# EAGLE schematic schema (EAGLE 6.5.0)
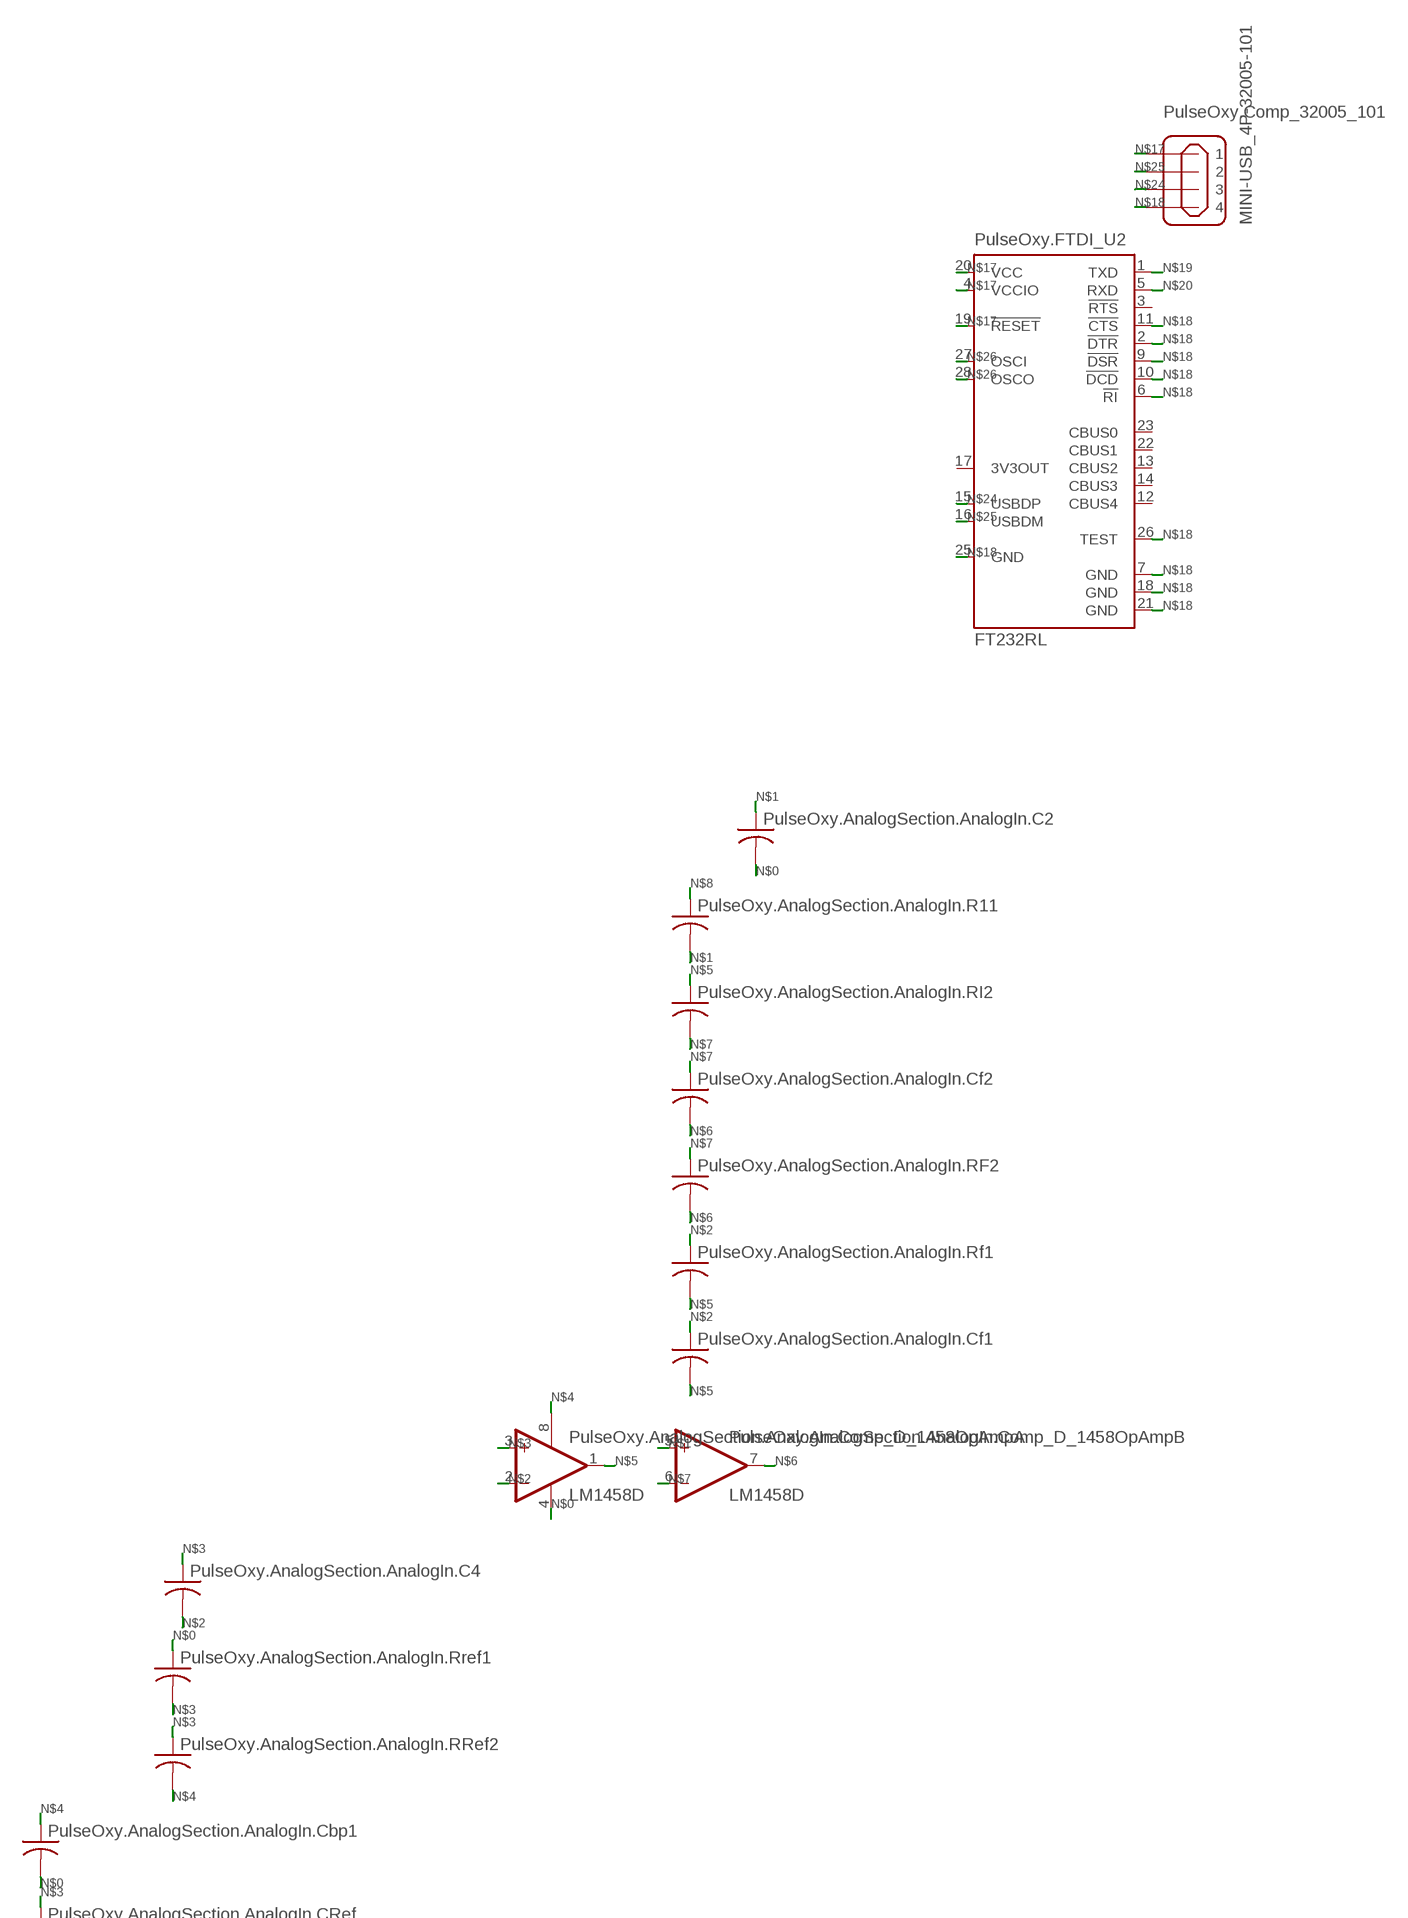
[diagram p0: schematic, sheet 1, part 1 of 2]
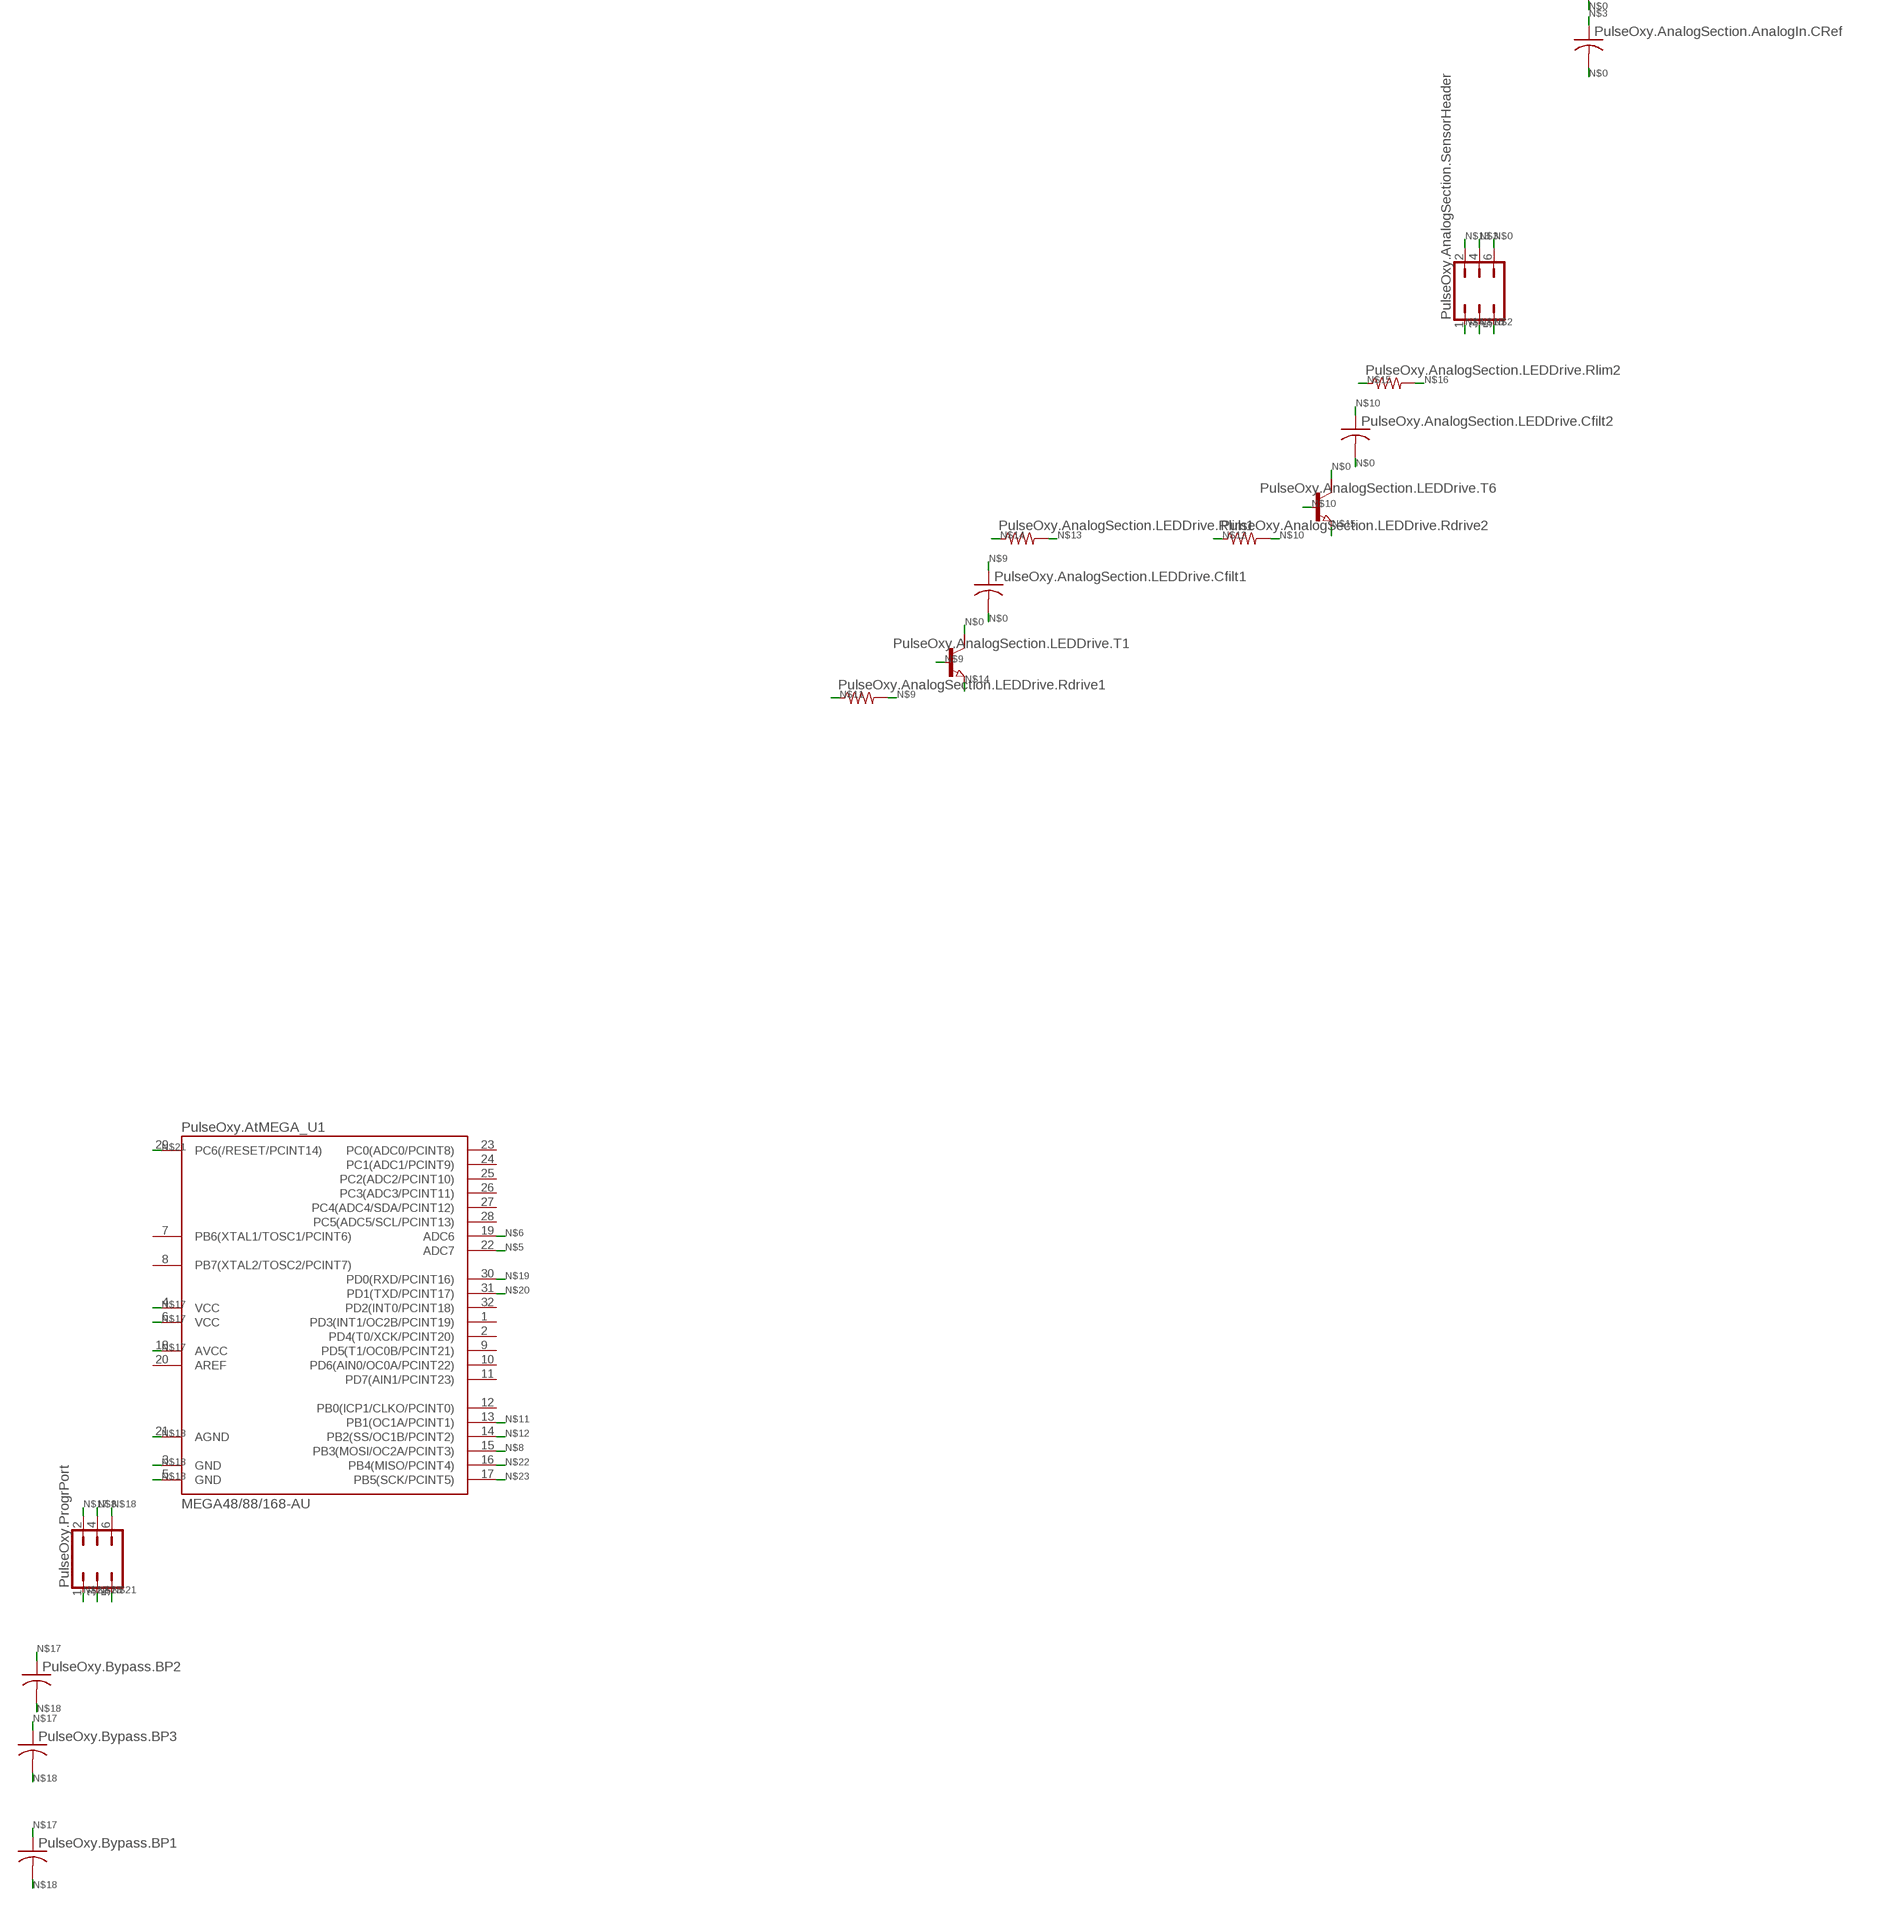
[diagram p1: schematic, sheet 1, part 2 of 2]

## Parts
PulseOxy.AnalogSection.AnalogIn.C2  C-USC0805  [C0805]
PulseOxy.AnalogSection.AnalogIn.C4  C-USC0805  [C0805]
PulseOxy.AnalogSection.AnalogIn.Cbp1  C-USC0805  [C0805]
PulseOxy.AnalogSection.AnalogIn.Cf1  C-USC0805  [C0805]
PulseOxy.AnalogSection.AnalogIn.Cf2  C-USC0805  [C0805]
PulseOxy.AnalogSection.AnalogIn.Comp_D_1458OpAmp  LM1458D  [SO08]
PulseOxy.AnalogSection.AnalogIn.CRef  C-USC0805  [C0805]
PulseOxy.AnalogSection.AnalogIn.R11  C-USC0603  [C0603]
PulseOxy.AnalogSection.AnalogIn.Rf1  C-USC0603  [C0603]
PulseOxy.AnalogSection.AnalogIn.RF2  C-USC0603  [C0603]
PulseOxy.AnalogSection.AnalogIn.RI2  C-USC0603  [C0603]
PulseOxy.AnalogSection.AnalogIn.Rref1  C-USC0603  [C0603]
PulseOxy.AnalogSection.AnalogIn.RRef2  C-USC0603  [C0603]
PulseOxy.AnalogSection.LEDDrive.Cfilt1  C-USC0805  [C0805]
PulseOxy.AnalogSection.LEDDrive.Cfilt2  C-USC0805  [C0805]
PulseOxy.AnalogSection.LEDDrive.Rdrive1  R-US_R0603  [R0603]
PulseOxy.AnalogSection.LEDDrive.Rdrive2  R-US_R0603  [R0603]
PulseOxy.AnalogSection.LEDDrive.Rlim1  R-US_R0603  [R0603]
PulseOxy.AnalogSection.LEDDrive.Rlim2  R-US_R0603  [R0603]
PulseOxy.AnalogSection.LEDDrive.T1  NPN-TRANSISTIOR-2COLSOT143  [SOT143]
PulseOxy.AnalogSection.LEDDrive.T6  NPN-TRANSISTIOR-2COLSOT143  [SOT143]
PulseOxy.AnalogSection.SensorHeader  JP3Q  [JP3Q]
PulseOxy.AtMEGA_U1  MEGA48/88/168-AU  [TQFP32-08]
PulseOxy.Bypass.BP1  C-USC0805  [C0805]
PulseOxy.Bypass.BP2  C-USC0805  [C0805]
PulseOxy.Bypass.BP3  C-USC0805  [C0805]
PulseOxy.Comp_32005_101  MINI-USB_4P-32005-101  [32005-101]
PulseOxy.FTDI_U2  FT232RL  [SSOP28]
PulseOxy.ProgrPort  JP3Q  [JP3Q]

## Nets
N$0: PulseOxy.AnalogSection.AnalogIn.C2.2 PulseOxy.AnalogSection.AnalogIn.Cbp1.2 PulseOxy.AnalogSection.AnalogIn.Comp_D_1458OpAmp.4(P:V-) PulseOxy.AnalogSection.AnalogIn.CRef.2 PulseOxy.AnalogSection.AnalogIn.Rref1.1 PulseOxy.AnalogSection.LEDDrive.Cfilt1.2 PulseOxy.AnalogSection.LEDDrive.Cfilt2.2 PulseOxy.AnalogSection.LEDDrive.T1.2(C) PulseOxy.AnalogSection.LEDDrive.T6.2(C) PulseOxy.AnalogSection.SensorHeader.6
N$1: PulseOxy.AnalogSection.AnalogIn.C2.1 PulseOxy.AnalogSection.AnalogIn.Comp_D_1458OpAmp.5(B:+IN) PulseOxy.AnalogSection.AnalogIn.R11.2
N$2: PulseOxy.AnalogSection.AnalogIn.C4.2 PulseOxy.AnalogSection.AnalogIn.Cf1.1 PulseOxy.AnalogSection.AnalogIn.Comp_D_1458OpAmp.2(A:-IN) PulseOxy.AnalogSection.AnalogIn.Rf1.1 PulseOxy.AnalogSection.SensorHeader.5
N$3: PulseOxy.AnalogSection.AnalogIn.C4.1 PulseOxy.AnalogSection.AnalogIn.Comp_D_1458OpAmp.3(A:+IN) PulseOxy.AnalogSection.AnalogIn.CRef.1 PulseOxy.AnalogSection.AnalogIn.Rref1.2 PulseOxy.AnalogSection.AnalogIn.RRef2.1 PulseOxy.AnalogSection.SensorHeader.4
N$4: PulseOxy.AnalogSection.AnalogIn.Cbp1.1 PulseOxy.AnalogSection.AnalogIn.Comp_D_1458OpAmp.8(P:V+) PulseOxy.AnalogSection.AnalogIn.RRef2.2 PulseOxy.AnalogSection.SensorHeader.1
N$5: PulseOxy.AnalogSection.AnalogIn.Cf1.2 PulseOxy.AnalogSection.AnalogIn.Comp_D_1458OpAmp.1(A:OUT) PulseOxy.AnalogSection.AnalogIn.Rf1.2 PulseOxy.AnalogSection.AnalogIn.RI2.1 PulseOxy.AtMEGA_U1.22(ADC7)
N$6: PulseOxy.AnalogSection.AnalogIn.Cf2.2 PulseOxy.AnalogSection.AnalogIn.Comp_D_1458OpAmp.7(B:OUT) PulseOxy.AnalogSection.AnalogIn.RF2.2 PulseOxy.AtMEGA_U1.19(ADC6)
N$7: PulseOxy.AnalogSection.AnalogIn.Cf2.1 PulseOxy.AnalogSection.AnalogIn.Comp_D_1458OpAmp.6(B:-IN) PulseOxy.AnalogSection.AnalogIn.RF2.1 PulseOxy.AnalogSection.AnalogIn.RI2.2
N$8: PulseOxy.AnalogSection.AnalogIn.R11.1 PulseOxy.AtMEGA_U1.15(PB3(MOSI/OC2A/PCINT3)) PulseOxy.ProgrPort.4
N$9: PulseOxy.AnalogSection.LEDDrive.Cfilt1.1 PulseOxy.AnalogSection.LEDDrive.Rdrive1.2 PulseOxy.AnalogSection.LEDDrive.T1.1(B)
N$10: PulseOxy.AnalogSection.LEDDrive.Cfilt2.1 PulseOxy.AnalogSection.LEDDrive.Rdrive2.2 PulseOxy.AnalogSection.LEDDrive.T6.1(B)
N$11: PulseOxy.AnalogSection.LEDDrive.Rdrive1.1 PulseOxy.AtMEGA_U1.13(PB1(OC1A/PCINT1))
N$12: PulseOxy.AnalogSection.LEDDrive.Rdrive2.1 PulseOxy.AtMEGA_U1.14(PB2(SS/OC1B/PCINT2))
N$13: PulseOxy.AnalogSection.LEDDrive.Rlim1.2 PulseOxy.AnalogSection.SensorHeader.2
N$14: PulseOxy.AnalogSection.LEDDrive.Rlim1.1 PulseOxy.AnalogSection.LEDDrive.T1.3(E)
N$15: PulseOxy.AnalogSection.LEDDrive.Rlim2.1 PulseOxy.AnalogSection.LEDDrive.T6.3(E)
N$16: PulseOxy.AnalogSection.LEDDrive.Rlim2.2 PulseOxy.AnalogSection.SensorHeader.3
N$17: PulseOxy.AtMEGA_U1.4(VCC) PulseOxy.AtMEGA_U1.6(VCC) PulseOxy.AtMEGA_U1.18(AVCC) PulseOxy.Bypass.BP1.1 PulseOxy.Bypass.BP2.1 PulseOxy.Bypass.BP3.1 PulseOxy.Comp_32005_101.1 PulseOxy.FTDI_U2.4(VCCIO) PulseOxy.FTDI_U2.19(!RESET) PulseOxy.FTDI_U2.20(VCC) PulseOxy.ProgrPort.2
N$18: PulseOxy.AtMEGA_U1.3(GND) PulseOxy.AtMEGA_U1.5(GND) PulseOxy.AtMEGA_U1.21(AGND) PulseOxy.Bypass.BP1.2 PulseOxy.Bypass.BP2.2 PulseOxy.Bypass.BP3.2 PulseOxy.Comp_32005_101.4 PulseOxy.FTDI_U2.2(!DTR) PulseOxy.FTDI_U2.6(!RI) PulseOxy.FTDI_U2.7(GND) PulseOxy.FTDI_U2.9(!DSR) PulseOxy.FTDI_U2.10(!DCD) PulseOxy.FTDI_U2.11(!CTS) PulseOxy.FTDI_U2.18(GND) PulseOxy.FTDI_U2.21(GND) PulseOxy.FTDI_U2.25(GND) PulseOxy.FTDI_U2.26(TEST) PulseOxy.ProgrPort.6
N$19: PulseOxy.AtMEGA_U1.30(PD0(RXD/PCINT16)) PulseOxy.FTDI_U2.1(TXD)
N$20: PulseOxy.AtMEGA_U1.31(PD1(TXD/PCINT17)) PulseOxy.FTDI_U2.5(RXD)
N$21: PulseOxy.AtMEGA_U1.29(PC6(/RESET/PCINT14)) PulseOxy.ProgrPort.5
N$22: PulseOxy.AtMEGA_U1.16(PB4(MISO/PCINT4)) PulseOxy.ProgrPort.1
N$23: PulseOxy.AtMEGA_U1.17(PB5(SCK/PCINT5)) PulseOxy.ProgrPort.3
N$24: PulseOxy.Comp_32005_101.3 PulseOxy.FTDI_U2.15(USBDP)
N$25: PulseOxy.Comp_32005_101.2 PulseOxy.FTDI_U2.16(USBDM)
N$26: PulseOxy.FTDI_U2.27(OSCI) PulseOxy.FTDI_U2.28(OSCO)
Unconnected: PulseOxy.AnalogSection.LEDDrive.T1.4(C/) PulseOxy.AnalogSection.LEDDrive.T6.4(C/) PulseOxy.AtMEGA_U1.1(PD3(INT1/OC2B/PCINT19)) PulseOxy.AtMEGA_U1.2(PD4(T0/XCK/PCINT20)) PulseOxy.AtMEGA_U1.7(PB6(XTAL1/TOSC1/PCINT6)) PulseOxy.AtMEGA_U1.8(PB7(XTAL2/TOSC2/PCINT7)) PulseOxy.AtMEGA_U1.9(PD5(T1/OC0B/PCINT21)) PulseOxy.AtMEGA_U1.10(PD6(AIN0/OC0A/PCINT22)) PulseOxy.AtMEGA_U1.11(PD7(AIN1/PCINT23)) PulseOxy.AtMEGA_U1.12(PB0(ICP1/CLKO/PCINT0)) PulseOxy.AtMEGA_U1.20(AREF) PulseOxy.AtMEGA_U1.23(PC0(ADC0/PCINT8)) PulseOxy.AtMEGA_U1.24(PC1(ADC1/PCINT9)) PulseOxy.AtMEGA_U1.25(PC2(ADC2/PCINT10)) PulseOxy.AtMEGA_U1.26(PC3(ADC3/PCINT11)) PulseOxy.AtMEGA_U1.27(PC4(ADC4/SDA/PCINT12)) PulseOxy.AtMEGA_U1.28(PC5(ADC5/SCL/PCINT13)) PulseOxy.AtMEGA_U1.32(PD2(INT0/PCINT18)) PulseOxy.FTDI_U2.3(!RTS) PulseOxy.FTDI_U2.12(CBUS4) PulseOxy.FTDI_U2.13(CBUS2) PulseOxy.FTDI_U2.14(CBUS3) PulseOxy.FTDI_U2.17(3V3OUT) PulseOxy.FTDI_U2.22(CBUS1) PulseOxy.FTDI_U2.23(CBUS0)

## Library data of the parts
PulseOxy.AnalogSection.AnalogIn.C2 PulseOxy.AnalogSection.AnalogIn.C4 PulseOxy.AnalogSection.AnalogIn.Cbp1 PulseOxy.AnalogSection.AnalogIn.Cf1 PulseOxy.AnalogSection.AnalogIn.Cf2 PulseOxy.AnalogSection.AnalogIn.CRef PulseOxy.AnalogSection.AnalogIn.R11 PulseOxy.AnalogSection.AnalogIn.Rf1 PulseOxy.AnalogSection.AnalogIn.RF2 PulseOxy.AnalogSection.AnalogIn.RI2 PulseOxy.AnalogSection.AnalogIn.Rref1 PulseOxy.AnalogSection.AnalogIn.RRef2 PulseOxy.AnalogSection.LEDDrive.Cfilt1 PulseOxy.AnalogSection.LEDDrive.Cfilt2 PulseOxy.Bypass.BP1-PulseOxy.Bypass.BP3 = resistor:C-US
PulseOxy.AnalogSection.AnalogIn.Comp_D_1458OpAmp = linear:*1458
PulseOxy.AnalogSection.LEDDrive.Rdrive1 PulseOxy.AnalogSection.LEDDrive.Rdrive2 PulseOxy.AnalogSection.LEDDrive.Rlim1 PulseOxy.AnalogSection.LEDDrive.Rlim2 = rcl:R-US_
PulseOxy.AnalogSection.LEDDrive.T1 PulseOxy.AnalogSection.LEDDrive.T6 = semicon-smd-ipc:NPN-TRANSISTIOR-2COL
PulseOxy.AnalogSection.SensorHeader PulseOxy.ProgrPort = jumper:JP3Q
PulseOxy.AtMEGA_U1 = avr-4:MEGA48/88/168
PulseOxy.Comp_32005_101 = con-cypressindustries:MINI-USB_4P-; OC_FARNELL: unknown; OC_NEWARK: unknown
PulseOxy.FTDI_U2 = ftdichip:FT232R; MPN: FT232RL; OC_FARNELL: 1146032; OC_NEWARK: 91K9918